# EAGLE design controller (EAGLE 6.2)
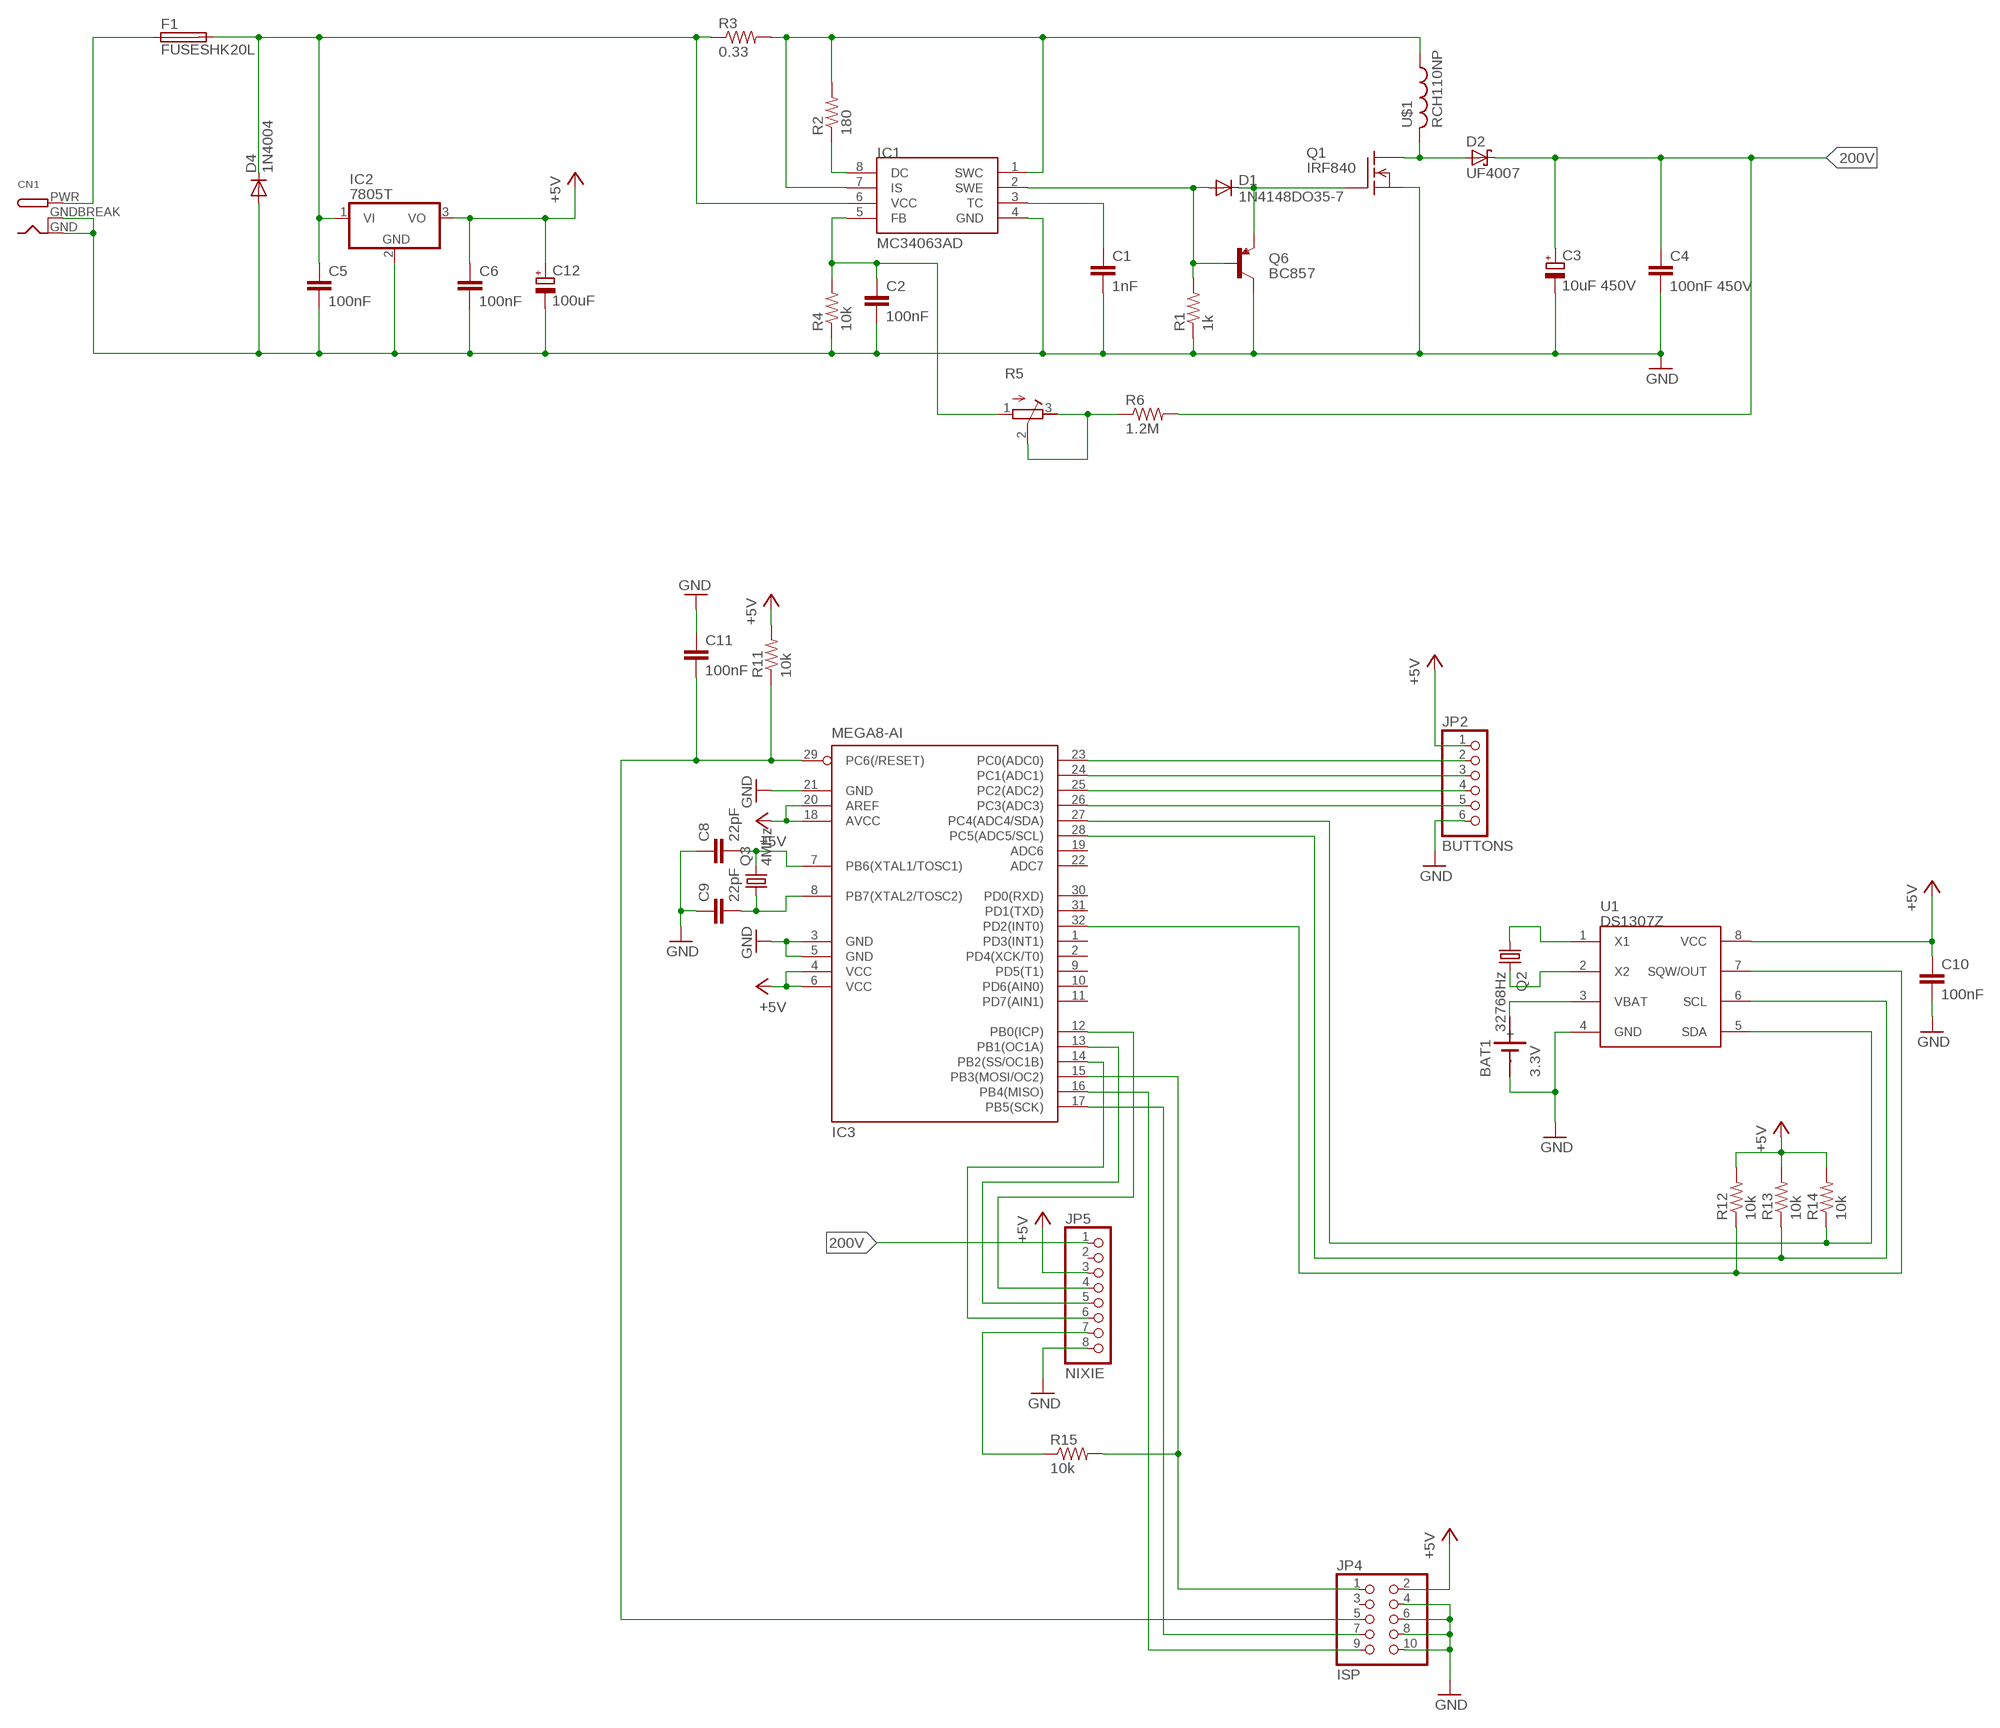
[diagram p0: schematic, sheet 1]

## Parts
BAT1  3.3V  SN2032  [SN2032]
C1  1nF  CAP0805  [0805]
C2  100nF  CAP0805  [0805]
C3  10uF 450V  CPOL-EUE5-13  [E5-13]
C4  100nF 450V  CAPPTH3  [CAP-PTH-LARGE]
C5  100nF  CAP0805  [0805]
C6  100nF  CAP0805  [0805]
C8  22pF  CAP0805  [0805]
C9  22pF  CAP0805  [0805]
C10  100nF  CAP0805  [0805]
C11  100nF  CAP0805  [0805]
C12  100uF  CPOL-EUE3.5-8  [E3,5-8]
CN1  DCBARRELPTH  [DCJACK_2MM_PTH]
D1  1N4148DO35-7  [DO35-7]
D2  UF4007  1N5817-B  [DO41-7.6]
D4  1N4004  [DO41-10]
F1  FUSESHK20L  [SHK20L]
IC1  MC34063AD  [SOIC8]
IC2  7805T  [TO220H]
IC3  MEGA8-AI  [TQFP32-08]
JP2  BUTTONS  PINHD-1X6/90  [1X06/90]
JP4  ISP  PINHD-2X5/90  [2X05/90]
JP5  NIXIE  PINHD-1X8  [1X08]
Q1  IRF840  [TO220]
Q2  32768Hz  CRYSTALTC38H  [TC38H]
Q3  4MHz  CRYSTALHC49U-V  [HC49U-V]
Q6  BC857  TRANSISTOR_PNPSMD  [SOT23-3]
R1  1k  RESISTOR0805-RES  [0805]
R2  180  RESISTOR0805-RES  [0805]
R3  0.33  RESISTORPTH-2W  [AXIAL-0.8]
R4  10k  RESISTOR0805-RES  [0805]
R5  R-TRIMM64Z  [RTRIM64Z]
R6  1.2M  RESISTORPTH-2W  [AXIAL-0.8]
R11  10k  RESISTOR0805-RES  [0805]
R12  10k  RESISTOR0805-RES  [0805]
R13  10k  RESISTOR0805-RES  [0805]
R14  10k  RESISTOR0805-RES  [0805]
R15  10k  RESISTOR0805-RES  [0805]
U1  DS1307Z  [SOIC8]
U$1  RCH110NP  [RCH110NP]

## Nets
200V: C3.+ C4.1 D2.C JP5.1 R6.P$2
+5V: C6.1 C10.1 C12.+ IC2.3(VO) IC3.4(VCC) IC3.6(VCC) IC3.18(AVCC) IC3.20(AREF) JP2.1 JP4.2 JP5.3 R11.2 R12.2 R13.2 R14.2 U1.8(VCC)
GND: BAT1.- C1.2 C2.2 C3.- C4.2 C5.2 C6.2 C8.1 C9.1 C10.2 C11.1 C12.- CN1.GND CN1.GNDBREAK D4.A IC1.4(GND) IC2.2(GND) IC3.3(GND) IC3.5(GND) IC3.21(GND) JP2.6 JP4.4 JP4.6 JP4.8 JP4.10 JP5.8 Q1.3(S) Q6.3(C) R1.1 R4.1 U1.4(GND)
N$1: D1.C Q1.1(G) Q6.2(E)
N$2: D1.A IC1.2(SWE) Q6.1(B) R1.2
N$3: IC3.23(PC0(ADC0)) JP2.2
N$4: D2.A Q1.2(D) U$1.B
N$5: C1.1 IC1.3(TC)
N$6: IC1.8(DC) R2.1
N$7: IC1.1(SWC) IC1.7(IS) R2.2 R3.P$2 U$1.A
N$8: C5.1 D4.C F1.2A IC1.6(VCC) IC2.1(VI) R3.P$1
N$9: C11.2 IC3.29(PC6(/RESET)) JP4.5 R11.1
N$10: C2.1 IC1.5(FB) R4.2 R5.1(A)
N$11: R5.2(S) R5.3(E) R6.P$1
N$12: IC3.27(PC4(ADC4/SDA)) R14.1 U1.5(SDA)
N$13: IC3.24(PC1(ADC1)) JP2.3
N$14: IC3.25(PC2(ADC2)) JP2.4
N$15: IC3.26(PC3(ADC3)) JP2.5
N$16: IC3.28(PC5(ADC5/SCL)) R13.1 U1.6(SCL)
N$17: IC3.32(PD2(INT0)) R12.1 U1.7(SQW/OUT)
N$18: IC3.15(PB3(MOSI/OC2)) JP4.1 R15.2
N$19: IC3.17(PB5(SCK)) JP4.7
N$20: IC3.16(PB4(MISO)) JP4.9
N$23: BAT1.+ U1.3(VBAT)
N$24: IC3.12(PB0(ICP)) JP5.4
N$25: Q2.1 U1.1(X1)
N$26: Q2.2 U1.2(X2)
N$27: C8.2 IC3.7(PB6(XTAL1/TOSC1)) Q3.2
N$28: C9.2 IC3.8(PB7(XTAL2/TOSC2)) Q3.1
N$29: CN1.PWR F1.1A
N$30: IC3.13(PB1(OC1A)) JP5.5
N$31: IC3.14(PB2(SS/OC1B)) JP5.6
N$32: JP5.7 R15.1
Unconnected: IC3.1(PD3(INT1)) IC3.2(PD4(XCK/T0)) IC3.9(PD5(T1)) IC3.10(PD6(AIN0)) IC3.11(PD7(AIN1)) IC3.19(ADC6) IC3.22(ADC7) IC3.30(PD0(RXD)) IC3.31(PD1(TXD)) JP4.3 JP5.2

## Library data of the parts
BAT1 = sn2032:SN2032: LI BATTERY
C1 C2 C4-C6 C8-C11 = SparkFun-Passives:CAP: Capacitor Standard 0603 ceramic capacitor, and 0.1" leaded capacitor.
C3 = resistor:CPOL-EU: POLARIZED CAPACITOR, European symbol
C12 = rcl:CPOL-EU: POLARIZED CAPACITOR, European symbol
CN1 = adafruit:DCBARREL: 2.0mm DC Barrel Jack DCJACK_2MM_PTH - Through Hole Jack (4UConnector: 05537)
D1 = diode:1N4148: DIODE high speed (Philips)
D2 = diode:1N581*: 1.0A SCHOTTKY BARRIER RECTIFIER Source: http://www.diodes.com/datasheets/ds23001.pdf
D4 = adafruit:1N4004: DIODE General purpose 1N400x type rectifier (With bigger pads) http://www.ladyada.net/library/pcb/eaglelibrary.html
F1 = fuse:FUSE: Fuse; OC_FARNELL: unknown; OC_NEWARK: unknown
IC1 = mc34063:MC34063
IC2 = linear:78*: Positive VOLTAGE REGULATOR Source: http://cache.national.com/ds/LM/LM78L05.pdf http://www.fairchildsemi.com/ds/LM/LM7805.pdf
IC3 = atmel:MEGA8: MICROCONTROLLER 8 Kbytes FLASH, 1 kbytes SRAM, 512 bytes EEPROM, USART, 6-channel 10 bit ADC, 2-channel 8 bit ADC Pin compatible with Atmega48, ATMega88, ATMega168 Source: avr.lbr; MPN: ATMEGA8-16AU; OC_FARNELL: 9171371; OC_NEWARK: 73M8863
JP2 = pinhead:PINHD-1X6: PIN HEADER
JP4 = pinhead:PINHD-2X5: PIN HEADER
JP5 = pinhead:PINHD-1X8: PIN HEADER
Q1 = transistor-fet:IRF840: N-Channel Enhancement MOSFET (HEXFET); 500V; 8A; 0,85Ohm
Q2 = crystal:CRYSTAL: CRYSTAL; OC_FARNELL: unknown; OC_NEWARK: unknown
Q3 = crystal:CRYSTAL: CRYSTAL; OC_FARNELL: 1666969; OC_NEWARK: unknown
Q6 = SparkFun-DiscreteSemi:TRANSISTOR_PNP: Generic PNP BJT Double check pinouts against datasheets- not all devices are the same! MMBT3906 - 40V 200mA SOT-23 (TRANS-08052) MMBT4403 - 40V 600mA SOT-23 (TRANS-09245)
R1-R4 R6 R11-R15 = SparkFun-Passives:RESISTOR: Resistor Basic schematic elements and footprints for 0603, 1206, and PTH resistors.
R5 = rcl:R-TRIMM: Trimm resistor
U1 = nixie:DS1307Z
U$1 = nixie:RCH110NP

## Board
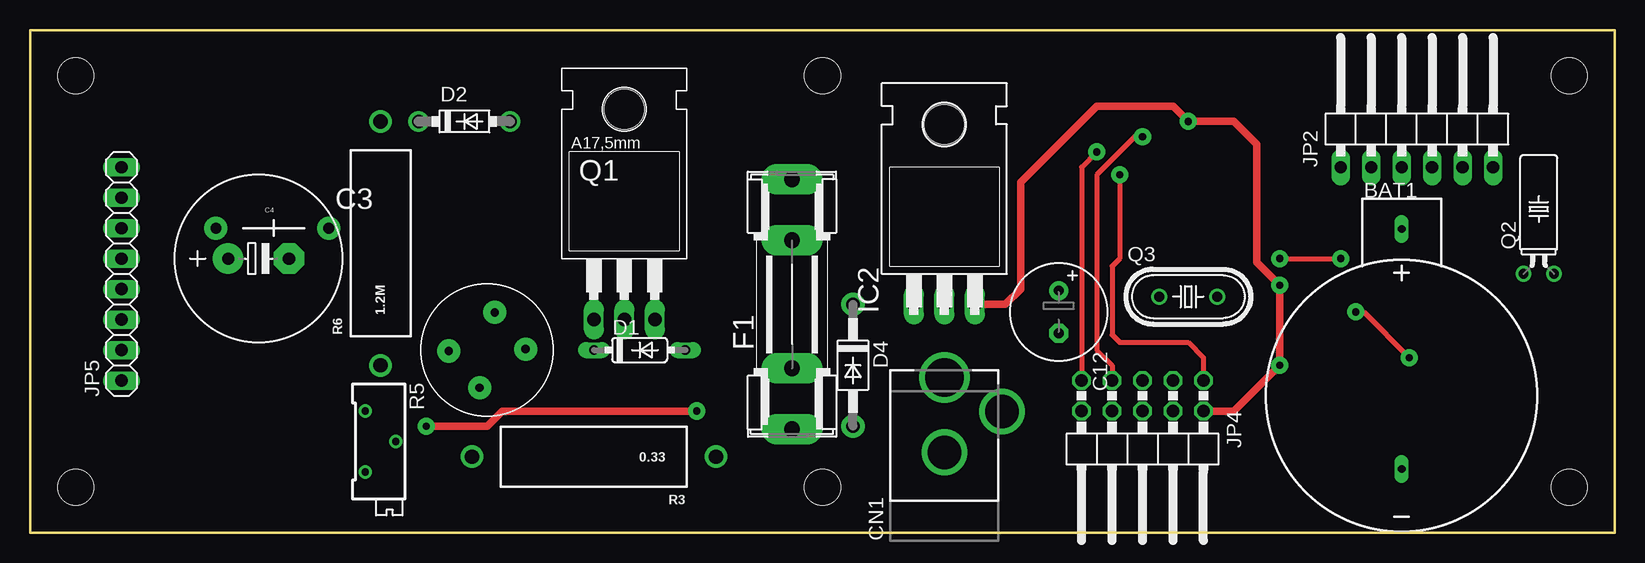
[diagram p1: board, top side]
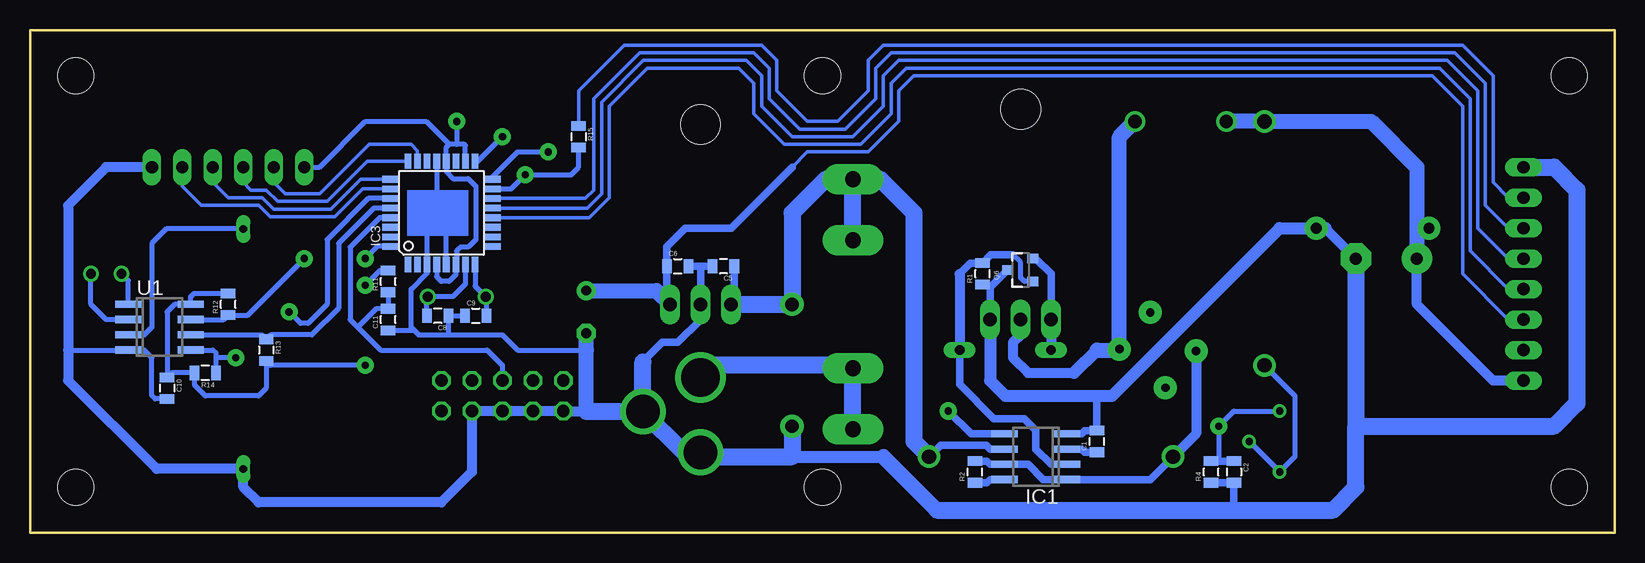
[diagram p2: board, bottom side, seen from below]

Size 132.08 x 41.91 mm. Coordinates in mm from the lower left corner, seen from the top.
Outline: 0,0 132.08,0 132.08,41.91 0,41.91 0,0
Copper layers (1*16): Top 0.035mm / dielectric 1.5mm / Bottom 0.035mm
Design rules: minimum track width 10mil, minimum drill 24mil, track to track 8mil, track to pad 8mil, pad to pad 8mil, via to via 8mil, smd to smd 8mil, copper to edge 40mil, drill to drill 8mil, minimum pad ring 10mil, minimum via ring 8mil, stop-mask expansion 4mil, vias tented up to drill 0mil, thermal gap 10mil
Holes 3 mm at 3.81,38.1 3.81,3.81 128.27,38.1 128.27,3.81 66.04,38.1 66.04,3.81

### Footprints (pad centres in the part's own frame; a part is rotated, then mirrored left to right if it is on the bottom)
SN2032 = drill 0.65 long: + 0,13.9; - 0,-6.1
0805 = smd 0.8 x 1.2: 1 -0.9,0; 2 0.9,0
E5-13 = drill 1.016 pad 2.54: + -2.54,0 | drill 1.016 pad 2.54 octagon: - 2.54,0
CAP-PTH-LARGE = drill 0.9 pad 1.905: 1 -4.826,0; 2 4.572,0
E3,5-8 = drill 0.813 pad 1.6: + -1.778,0 | drill 0.813 pad 1.6 octagon: - 1.778,0
DCJACK_2MM_PTH = drill 2.8: GND 0,7.35; GNDBREAK 4.8,10.75 | drill 3.2: PWR 0,13.6
DO35-7 = drill 0.813 long: A 3.81,0; C -3.81,0
DO41-7.6 = drill 1.1 pad 1.7: A 3.81,0; C -3.81,0
DO41-10 = drill 1.118 pad 1.93: A 5.08,0; C -5.08,0
SHK20L = drill 1.321 pad 2.54 long: 1A -10.414,0; 1B -5.334,0; 2A 10.414,0; 2B 5.334,0
SOIC8 = smd 0.6 x 2.2: 1 -1.905,-2.6; 2 -0.635,-2.6; 3 0.635,-2.6; 4 1.905,-2.6; 5 1.905,2.6; 6 0.635,2.6; 7 -0.635,2.6; 8 -1.905,2.6
TO220H = drill 1.118 long: 1 -2.54,-10.16; 2 0,-10.16; 3 2.54,-10.16 | hole 3.302: 0,4.826
TQFP32-08 = smd 1.27 x 0.559: 1 -4.293,2.8; 2 -4.293,2; 3 -4.293,1.2; 4 -4.293,0.4; 5 -4.293,-0.4; 6 -4.293,-1.2; 7 -4.293,-2; 8 -4.293,-2.8; 17 4.293,-2.8; 18 4.293,-2; 19 4.293,-1.2; 20 4.293,-0.4; 21 4.293,0.4; 22 4.293,1.2; 23 4.293,2; 24 4.293,2.8 | smd 0.559 x 1.27: 9 -2.8,-4.293; 10 -2,-4.293; 11 -1.2,-4.293; 12 -0.4,-4.293; 13 0.4,-4.293; 14 1.2,-4.293; 15 2,-4.293; 16 2.8,-4.293; 25 2.8,4.293; 26 2,4.293; 27 1.2,4.293; 28 0.4,4.293; 29 -0.4,4.293; 30 -1.2,4.293; 31 -2,4.293; 32 -2.8,4.293
1X06/90 = drill 1.016 long: 1 -6.35,-3.81; 2 -3.81,-3.81; 3 -1.27,-3.81; 4 1.27,-3.81; 5 3.81,-3.81; 6 6.35,-3.81
2X05/90 = drill 1.016 octagon: 1 -5.08,-6.35; 2 -5.08,-3.81; 3 -2.54,-6.35; 4 -2.54,-3.81; 5 0,-6.35; 6 0,-3.81; 7 2.54,-6.35; 8 2.54,-3.81; 9 5.08,-6.35; 10 5.08,-3.81
1X08 = drill 1.016 long: 1 -8.89,0; 2 -6.35,0; 3 -3.81,0; 4 -1.27,0; 5 1.27,0; 6 3.81,0; 7 6.35,0; 8 8.89,0
TO220 = drill 1.118 long: 1 -2.54,-6.35; 2 0,-6.35; 3 2.54,-6.35 | hole 3.302: 0,11.176
TC38H = drill 0.813: 1 -1.27,0; 2 1.27,0
HC49U-V = drill 0.813: 1 -2.413,0; 2 2.413,0
SOT23-3 = smd 0.8 x 0.9: 1 -0.95,-1; 2 0.95,-1; 3 0,1.1
AXIAL-0.8 = drill 1.2 pad 1.88: P$1 -10.16,0; P$2 10.16,0
RTRIM64Z = drill 0.61: 1 0,-2.54; 2 -2.54,0; 3 0,2.54
RCH110NP = drill 0.7 pad 1.93: A 2,2.5; B -2,-2.5; NC1 -2,2.5; NC2 2,-2.5

### Placement (x,y rotation side)
BAT1  114.3,11.43 0 top
C1  43.18,7.62 90 bottom
C2  31.75,5.08 270 bottom
C3  19.05,22.86 0 top
C4  20.32,25.4 0 top
C5  74.3,22.23 180 bottom
C6  78.11,22.23 0 bottom
C8  98.11,18.1 180 bottom
C9  94.93,18.1 0 bottom
C10  120.65,12.06 270 bottom
C11  102.23,17.78 90 bottom
C12  85.72,18.41 270 top
CN1  76.2,-0.64 0 top
D1  50.8,15.24 0 top
D2  36.2,34.29 0 top
D4  68.58,13.97 270 top
F1  63.5,19.05 90 top
IC1  48.26,6.35 90 bottom
IC2  76.2,29.21 0 top
IC3  97.79,26.67 90 bottom
JP2  115.57,34.29 0 top
JP4  92.71,6.35 180 top
JP5  7.62,21.59 90 top
Q1  49.53,24.13 0 top
Q2  125.73,21.59 0 top
Q3  96.52,19.68 0 top
Q6  49.53,21.91 90 bottom
R1  52.7,21.59 90 bottom
R2  53.34,5.08 90 bottom
R3  46.99,6.35 180 top
R4  33.66,5.08 90 bottom
R5  27.94,7.62 180 top
R6  29.21,24.13 90 top
R11  102.23,20.95 90 bottom
R12  115.57,19.05 90 bottom
R13  112.39,15.24 270 bottom
R14  117.47,13.34 180 bottom
R15  86.36,33.02 270 bottom
U1  121.28,17.14 270 bottom
U$1  38.1,15.24 130 top

### Tracks (layer width: path | path; a pad name or v marks a point on that pad's centre or on a via)
200V
  Bottom 0.813: C4.1 16.51,24.38 C3.+ 16.51,19.05 10.16,12.7 JP5.1
  Bottom 1.27: C3.+ 16.51,30.48 20.32,34.29 R6.P$2 D2.C
+5V  (via drill 0.6 pad 1.42)
  Top 0.61: IC2.3 81.28,19.05 82.55,20.32 82.55,29.21 88.9,35.56 95.25,35.56 v96.52,34.29 100.33,34.29 102.23,32.38 102.23,22.54 v104.14,20.64 v104.14,13.97 100.33,10.16 JP4.2
  Bottom 0.305: JP5.3 8.89,17.78 12.7,21.59 12.7,35.56 15.24,38.1 58.42,38.1 59.69,36.83 59.69,34.29 62.23,31.75 67.31,31.75 68.58,30.48
  Bottom 0.406: IC3.4 98.19,21.36 97.79,20.95 97.16,20.95 96.59,21.52 IC3.6 96.52,22.45 96.52,23.5 96.2,23.81 95.57,23.81 94.93,24.45 94.93,28.89 95.57,29.53 96.84,29.53 97.39,30.08 IC3.20 97.39,32.15 97.16,32.38 | IC3.18 95.79,32.29 95.89,32.38 96.52,32.38 | 96.52,32.38 97.16,32.38 | R12.2 118.42,19.95 118.69,19.68 U1.8 120.02,19.05 120.65,18.41 C10.1 120.28,13.34 R14.2 118.38,12.33 117.47,11.43 113.03,11.43 112.39,12.06 R13.2 112.03,13.97 v104.14,13.97 | JP2.1 107.95,30.48 104.14,34.29 99.06,34.29 97.16,32.38 | v96.52,34.29 96.52,32.38 | R11.2 102.92,21.86 v104.14,20.64
  Bottom 0.61: IC2.3 79,19.32 C6.1 79,23.86 77.47,25.4 73.66,25.4 68.58,30.48
  Bottom 1.27: C12.+ 79.88,20.19 IC2.3
GND
  Bottom 0.406: 98.99,25.33 IC3.3 98.99,21.66 100.33,20.32 100.33,17.14 100.06,16.88 | 98.99,25.33 99.06,25.4 | IC3.5 97.39,25 97.79,25.4 | 97.79,25.4 98.92,25.4 98.99,25.33 | IC3.21 98.19,25.8 97.79,25.4 | C10.2 121.66,11.16 121.92,11.43 121.92,14.61 122.56,15.24 U1.4 128.91,15.24 | C9.1 C8.1 97.21,16.56 97.16,16.51 | 100.06,16.88 99.69,16.51 97.16,16.51 | 97.16,16.51 92.71,16.51 91.44,15.24 85.72,15.24 | C11.1 100.06,16.88
  Bottom 0.61: IC1.4 44.45,8.26 44.19,8.52 C1.2 43.18,11.43 | C6.2 76.2,22.23 | 76.2,22.23 C5.2 | 76.2,22.23 IC2.2 76.2,17.78 78.11,15.88 79.38,15.88 81,14.25 | 87.58,10.12 JP4.10 | R4.1 C2.2 31.75,1.91 | Q1.3 52.07,20.47 | 52.07,20.47 Q6.3 | R1.1 52.29,20.69 52.07,20.47
  Bottom 0.813: C3.- 24.13,25.4 C4.2 | 85.72,10.12 87.58,10.12 | JP4.10 JP4.8 JP4.6 JP4.4 95.25,5.08 97.79,2.54 113.03,2.54 114.3,3.81 BAT1.- 121.53,5.33 128.91,12.7 128.91,15.24 128.91,27.3 125.73,30.48 JP2.6
  Bottom 1.016: Q1.3 52.07,12.7 50.8,11.43 43.18,11.43 41.91,11.43 27.94,25.4 24.13,25.4 | 68.58,6.35 60.96,6.35
  Bottom 1.27: 60.96,6.35 56.52,1.91 | 85.72,10.12 85.72,15.24 C12.-
  Bottom 1.422: JP5.8 5.08,30.48 3.17,28.57 3.17,10.79 5.08,8.89 21.59,8.89 | C3.- 21.59,8.89 | 56.52,1.91 31.75,1.91 23.5,1.91 21.59,3.81 21.59,8.89 | D4.A 68.58,6.35 76.2,6.35 CN1.GND 77.6,6.71 CN1.GNDBREAK | CN1.GNDBREAK 85.72,10.12 | CN1.GNDBREAK 81,14.25
N$1
  Bottom 0.61: Q1.1 46.99,21.59 48.26,22.86 Q6.2
  Bottom 0.813: Q1.1 D1.C
N$2
  Bottom 0.406: Q6.1 49.22,20.96 49.53,21.27 49.53,22.54 50.16,23.18
  Bottom 0.61: D1.A 54.61,12.38 51.75,9.53 49.21,9.53 48.26,8.57 48.26,6.99 46.99,5.71 IC1.2 | 54.61,21.59 53.71,22.49 R1.2 52.02,23.18 50.16,23.18
  Bottom 0.813: 54.61,21.59 D1.A
N$3
  Bottom 0.305: IC3.23 99.79,31.84 100.33,32.38 103.82,32.38 107.95,28.26 110.81,28.26 111.76,29.21 JP2.2
N$4
  Bottom 0.813: Q1.2 49.53,16.51 50.16,15.88 50.16,14.61 48.9,13.34 45.09,13.34 | 41.38,15.24 U$1.B
  Bottom 1.016: 45.09,13.34 43.18,15.24
  Bottom 1.27: U$1.B 41.3,32.99 D2.A | 43.18,15.24 41.38,15.24
N$5
  Bottom 0.61: C1.1 44.19,6.72 44.45,6.99 IC1.3
N$6
  Bottom 0.61: R2.1 52.34,4.18 52.07,4.45 IC1.8
N$7
  Bottom 0.61: R2.2 52.34,5.98 52.07,5.71 IC1.7 48.9,5.71 47.62,4.45 IC1.1 38.73,4.45 R3.P$2
  Bottom 0.813: U$1.A 34.9,8.28 R3.P$2
N$8
  Bottom 0.61: C5.1 73.39,19.32 IC2.1 | IC1.6 52.07,6.99 52.39,7.3 56.2,7.3 R3.P$1
  Bottom 1.422: R3.P$1 58.42,7.62 58.42,26.67 61.21,29.46 F1.2A 65.79,29.46 68.58,26.67 D4.C IC2.1
N$9
  Bottom 0.406: IC3.29 102.95,26.27 105.41,23.81 105.41,17.78 104.78,17.14 | 104.78,17.14 102.87,15.24 93.98,15.24 92.71,13.97 JP4.5 | R11.1 C11.2 103.24,18.68 104.78,17.14
N$10  (via drill 0.6 pad 1.42)
  Top 0.61: v55.56,10.16 39.37,10.16 38.1,8.89 v33.02,8.89
  Bottom 0.406: 33.02,5.98 v33.02,8.89 31.75,10.16 R5.1
  Bottom 0.61: IC1.5 53.66,8.26 v55.56,10.16 | C2.1 33.02,5.98 R4.2
N$11
  Bottom 0.406: R6.P$1 26.67,11.43 26.67,6.35 R5.3 R5.2
N$12  (via drill 0.6 pad 1.42)
  Top 0.406: v110.49,18.41 111.12,18.41 v114.94,14.61
  Bottom 0.406: U1.5 116.84,15.24 116.58,14.97 116.58,14.61 | R14.1 116.58,14.61 | IC3.27 103.89,27.87 107.31,24.45 107.31,19.05 108.9,17.46 109.54,17.46 v110.49,18.41 | v114.94,14.61 116.58,14.61
N$13
  Bottom 0.305: JP2.3 114.3,29.21 113.67,28.57 112.39,28.57 111.44,27.62 107.31,27.62 103.97,30.96 IC3.24
N$14
  Bottom 0.305: JP2.4 116.84,29.21 115.57,27.94 112.71,27.94 111.76,26.99 107,26.99 104.52,29.47 IC3.25
N$15
  Bottom 0.305: JP2.5 119.38,28.89 117.79,27.3 113.03,27.3 112.08,26.35 106.68,26.35 104.36,28.67 IC3.26
N$16
  Bottom 0.406: U1.6 112.77,16.51 R13.1 112.03,16.51 108.58,16.51 106.36,18.73 106.36,24.13 103.42,27.07 IC3.28
N$17  (via drill 0.6 pad 1.42)
  Top 0.406: v104.14,22.86 v109.22,22.86
  Bottom 0.406: U1.7 115.94,17.78 R12.1 113.93,18.15 v109.22,22.86 | IC3.32 103.13,23.87 v104.14,22.86
N$18  (via drill 0.6 pad 1.42)
  Top 0.406: v90.81,29.84 90.81,22.86 90.17,22.23 90.17,16.51 90.81,15.88 96.52,15.88 97.79,14.61 JP4.1
  Bottom 0.406: IC3.15 91.98,28.67 v90.81,29.84 87,29.84 86.36,30.48 R15.2
N$19  (via drill 0.6 pad 1.42)
  Top 0.406: v92.71,33.02 92.08,33.02 88.9,29.84 88.9,15.24 90.17,13.97 JP4.7
  Bottom 0.406: IC3.17 94.77,30.96 v92.71,33.02
N$20  (via drill 0.6 pad 1.42)
  Top 0.406: v88.9,31.75 87.63,30.48 JP4.9
  Bottom 0.406: IC3.16 93.5,29.69 91.44,31.75 v88.9,31.75
N$21
  Bottom 1.422: 63.5,24.13 63.5,29.21
N$23
  Bottom 0.406: BAT1.+ 120.72,25.33 121.92,24.13 121.92,17.14 122.56,16.51 U1.3
N$24
  Bottom 0.305: JP5.4 8.89,20.32 12.06,23.5 12.06,36.2 14.61,38.73 59.05,38.73 60.33,37.47 60.33,34.92 62.87,32.38 69.22,32.38 71.75,34.92 71.75,37.47 73.03,38.73 74.93,38.73 80.64,38.73 83.82,35.56 83.82,27.94 85.49,26.27 IC3.12
N$25
  Bottom 0.406: U1.1 123.89,21.02 Q2.1
N$26
  Bottom 0.406: U1.2 125.73,17.78 127,19.05 Q2.2
N$27
  Bottom 0.406: IC3.7 95.79,20.73 96.84,19.68 Q3.2 99.01,19.61 C8.2
N$28
  Bottom 0.406: IC3.8 94.99,20.57 Q3.1 94.03,19.61 C9.2
N$29
  Bottom 1.422: F1.1A 63.5,13.97 75.19,13.97 CN1.PWR
N$30
  Bottom 0.305: JP5.5 8.89,22.86 11.43,25.4 11.43,36.83 13.97,39.37 59.69,39.37 60.96,38.1 60.96,35.56 63.5,33.02 68.58,33.02 71.12,35.56 71.12,38.1 72.39,39.37 80.96,39.37 84.45,35.88 84.45,28.26 85.64,27.07 IC3.13
N$31
  Bottom 0.305: JP5.6 8.89,25.4 10.79,27.3 10.79,37.47 13.34,40.01 60.33,40.01 61.59,38.73 61.59,36.2 64.14,33.66 67.94,33.66 70.48,36.2 70.48,38.73 71.75,40.01 81.28,40.01 85.09,36.2 85.09,28.57 85.8,27.87 IC3.14
N$32
  Bottom 0.305: JP5.7 8.89,27.94 10.16,29.21 10.16,38.1 12.7,40.64 60.96,40.64 62.23,39.37 62.23,36.83 64.77,34.29 67.31,34.29 69.85,36.83 69.85,39.37 71.12,40.64 82.55,40.64 86.36,36.83 R15.1
(copper drawn outside any net)
  shapes: Bottom area x1